# Altium schematic sheet Sheet4.SchDoc
size A2
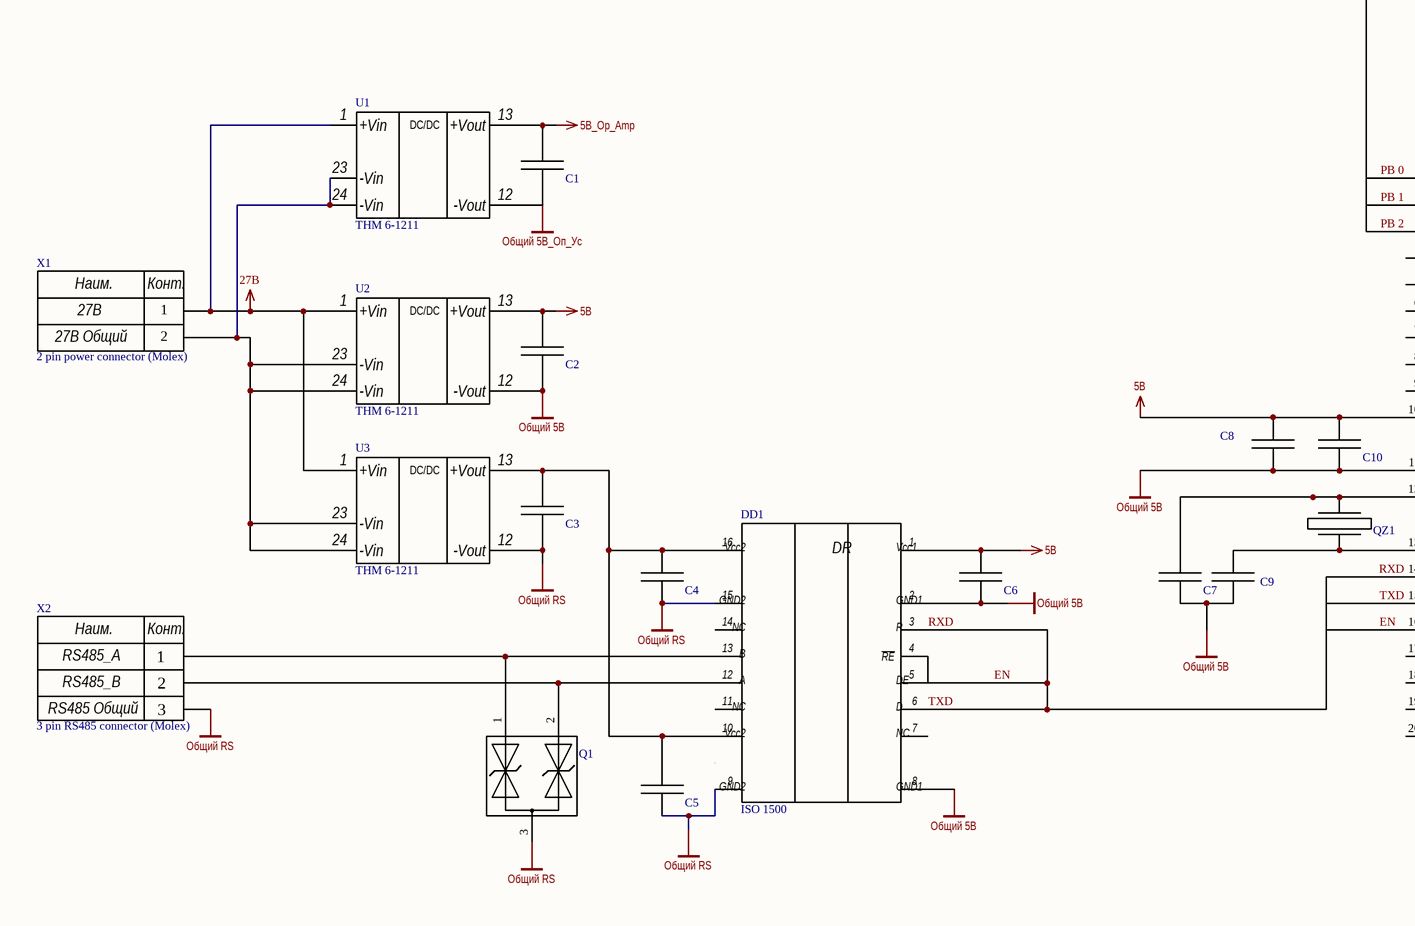
[diagram p0: Sheet4.SchDoc, left]
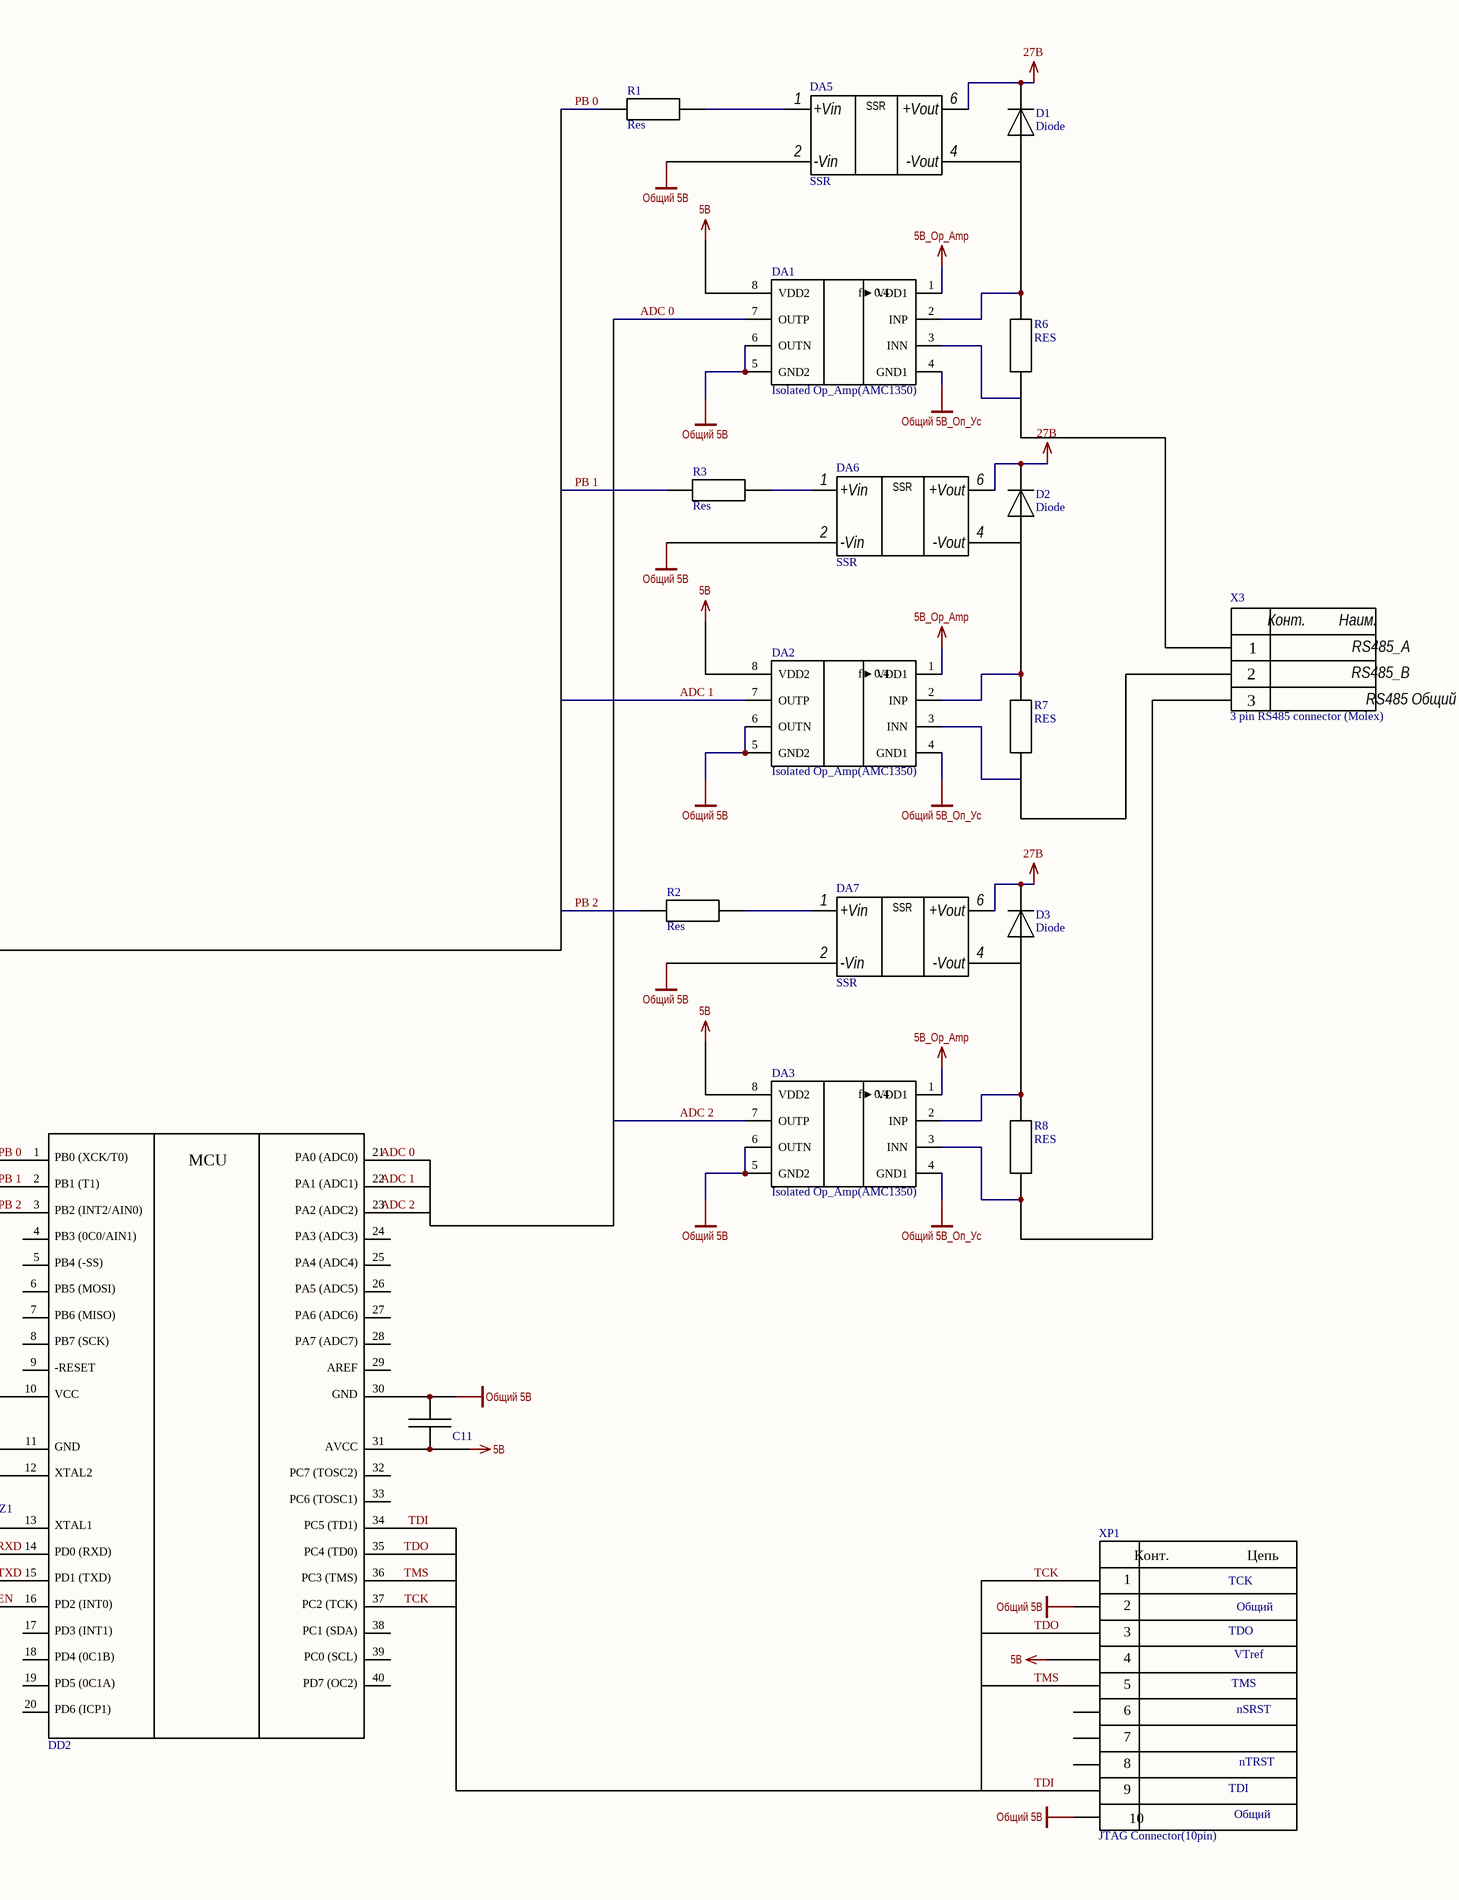
[diagram p1: Sheet4.SchDoc, right]

## Parts
C1  CAP  [0805]  (value not drawn)
C2  CAP  [0805]  (value not drawn)
C3  CAP  [0805]  (value not drawn)
C4  CAP  [0805]  (value not drawn)
C5  CAP  [0805]  (value not drawn)
C6  CAP  [0805]  (value not drawn)
C7  CAP  [0805]  (value not drawn)
C8  CAP  [0805]  (value not drawn)
C9  CAP  [0805]  (value not drawn)
C10  CAP  [0805]  (value not drawn)
C11  CAP  [0805]  (value not drawn)
D1  Diode  [Diode]
D2  Diode  [Diode]
D3  Diode  [Diode]
DA1  Isolated Op_Amp(AMC1350)  [SOIC-8]
DA2  Isolated Op_Amp(AMC1350)  [SOIC-8]
DA3  Isolated Op_Amp(AMC1350)  [SOIC-8]
DA5  SSR  [DIP6]
DA6  SSR  [DIP6]
DA7  SSR  [DIP6]
DD1  ISO 1500  [SSOP-16]
DD2  Atmega16  [TQFP-44]  (value not drawn)
Q1  Bipolar TVS diode  [SOT-23-3]  (value not drawn)
QZ1  Quartz rez  [XTAL]  (value not drawn)
R1  Res  [0805]
R2  Res  [0805]
R3  Res  [0805]
R6  RES  [0805]
R7  RES  [0805]
R8  RES  [0805]
U1  THM 6-1211  [CONV_THM_10-2411]
U2  THM 6-1211  [CONV_THM_10-2411]
U3  THM 6-1211  [CONV_THM_10-2411]
X1  2 pin power connector (Molex)  [MolexMicroFit 2x1]
X2  3 pin RS485 connector (Molex)  [MolexMicroFit 3x1]
X3  3 pin RS485 connector (Molex)  [MolexMicroFit 3x1]
XP1  JTAG Connector(10pin)  [PLD 10]

## Nets
5В: C2.2 C6.2 C9.2 C10.1 C11.1 DA1.8(VDD2) DA2.8(VDD2) DA3.8(VDD2) DD1.1 DD2.10 DD2.31 U2.13(+Vout) XP1.4
5В_Op_Amp: C1.2 DA1.1(VDD1) DA2.1(VDD1) DA3.1(VDD1) U1.13(+Vout)
27В: D1.1 D2.1 D3.1 DA5.6(+Vout) DA6.6(+Vout) DA7.6(+Vout) U1.1(+Vin) U2.1(+Vin) U3.1(+Vin) X1.1
Общий 5В: C2.1 C6.1 C7.2 C8.2 C9.1 C10.2 C11.2 DA1.5(GND2) DA1.6(OUTN) DA2.5(GND2) DA2.6(OUTN) DA3.5(GND2) DA3.6(OUTN) DA5.2(-Vin) DA6.2(-Vin) DA7.2(-Vin) DD1.2 DD1.8 DD2.11 DD2.30 U2.12(-Vout) XP1.2 XP1.10
Общий 5В_Оп_Ус: C1.1 DA1.4(GND1) DA2.4(GND1) DA3.4(GND1) U1.12(-Vout)
Общий RS: C3.1 C4.1 C5.1 DD1.9 DD1.15 Q1.3 U3.12(-Vout) X2.3
ADC 0: DA1.7(OUTP) DD2.21
ADC 1: DA2.7(OUTP) DD2.22
ADC 2: DA3.7(OUTP) DD2.23
EN: DD1.3 DD1.4(~{RE}) DD1.5 DD1.6 DD2.14 DD2.15 DD2.16  [also labelled RXD, TXD]
PB 0: DD2.1 R1.1
PB 1: DD2.2 R3.1
PB 2: DD2.3 R2.1
TCK: DD2.37 XP1.1
TDI: DD2.34 XP1.9
TDO: DD2.35 XP1.3
TMS: DD2.36 XP1.5
NetC3_2: C3.2 C4.2 C5.2 DD1.10 DD1.16 U3.13(+Vout)
NetC7_1: C7.1 DD2.12 QZ1.2
NetC8_1: C8.1 DD2.13 QZ1.1
NetD1_2: D1.2 DA1.2(INP) DA5.4(-Vout) R6.2
NetD2_2: D2.2 DA2.2(INP) DA6.4(-Vout) R7.2
NetD3_2: D3.2 DA3.2(INP) DA7.4(-Vout) R8.2
NetDA1_3: DA1.3(INN) R6.1 X3.1
NetDA2_3: DA2.3(INN) R7.1 X3.2
NetDA3_3: DA3.3(INN) R8.1 X3.3
NetDA5_1: DA5.1(+Vin) R1.2
NetDA6_1: DA6.1(+Vin) R3.2
NetDA7_1: DA7.1(+Vin) R2.2
NetDD1_12: DD1.12 Q1.2 X2.2
NetDD1_13: DD1.13 Q1.1 X2.1
NetU1_23: U1.23(-Vin) U1.24(-Vin) U2.23(-Vin) U2.24(-Vin) U3.23(-Vin) U3.24(-Vin) X1.2

Not connected (* = marked no-connect by the designer): DD1 7 11 14; DD2 4 5 6 7 8 9 17 18 19 20 24 25 26 27 28 29 32 33 38 39 40; XP1 6 7 8

## Notes on the sheet
- (in symbol 2 pin power connector (Molex)) Наим.; Конт.; 27В; 27В Общий
- (in symbol 3 pin RS485 connector (Molex)) Наим.; Конт.; RS485_A; RS485_B; RS485 Общий
- (in symbol Atmega16) PB0 (XCK/T0); PA0 (ADC0); MCU; PB1 (T1); PA1 (ADC1); PB2 (INT2/AIN0); PA2 (ADC2); PB3 (0C0/AIN1); PA3 (ADC3); PB4 (-SS); PA4 (ADC4); PB5 (MOSI); PA5 (ADC5); PB6 (MISO); PA6 (ADC6); PB7 (SCK); PA7 (ADC7); -RESET; AREF; VCC; GND; AVCC; XTAL2; PC7 (TOSC2); PC6 (TOSC1); XTAL1; PC5 (TD1); PD0 (RXD); PC4 (TD0); PD1 (TXD); PC3 (TMS); PD2 (INT0); PC2 (TCK); PD3 (INT1); PC1 (SDA); PD4 (0C1B); PC0 (SCL); PD5 (0C1A); PD7 (OC2); PD6 (ICP1)
- (in symbol Isolated Op_Amp(AMC1350)) f►0.4
- (in symbol JTAG Connector(10pin)) Конт.; Цепь; TCK; Общий; TDO; VTref; TMS; nSRST; nTRST; TDI
- (in symbol MAX 485) Vcc2; DR; Vcc1; GND2; GND1; NC; R; B; A; DE; D
- (in symbol THM 3-2411) DC/DC
- (in symbol THM 6-1211) DC/DC

## Library data of the parts
DD1 = MAX 485: ComponentLink1Description: Datasheet; ComponentLink1URL: https://www.ti.com/lit/ds/symlink/iso1500.pdf?ts=1632655446349&ref_url=https%253A%252F%252Fwww.ti.com%252Fisolation%252Fisolated-interfaces%252Frs-485-transceivers%252Foverview.html; ComponentLink2Description: Ссылка Chip&Dip; ComponentLink2URL: https://www.chipdip.ru/product1/8003093154
Q1 = Bipolar TVS: ComponentLink1Description: Chip&Dip; ComponentLink1URL: https://www.chipdip.ru/product/nup2105lt1g
QZ1 = QZ: ComponentLink1Description: Chip&Dip; ComponentLink1URL: https://www.chipdip.ru/product0/8006373177
U1 U2 = THM 6-1211: 6W 18-36Vin 5Vout; ComponentLink1Description: Chip&Dip; ComponentLink1URL: https://www.chipdip.ru/product0/8006915262
U3 = THM 3-2411: 3W 18-36Vin 5Vout; ComponentLink1Description: Chip&Dip; ComponentLink1URL: https://www.chipdip.ru/product0/8006388794
DA5-DA7 = SSR: ComponentLink1Description: CHIPDIP; ComponentLink1URL: https://www.chipdip.ru/product/pvg612s
XP1 = JTAG Connector(10pin): ComponentLink1Description: CHIPDIP; ComponentLink1URL: https://www.chipdip.ru/product/pld-10